# Altium schematic sheet FOC_Driver.SchDoc: 无刷电机控制器驱动电路
size A3; Engineer: LuHeQiu; Revision: v0.1; SheetNumber: 2; SheetTotal: 2; Website1: https://www.luheqiu.com; Website2: https://gitee.com/luheqiu; Contact: luheqiu@mail.luheqiu.com
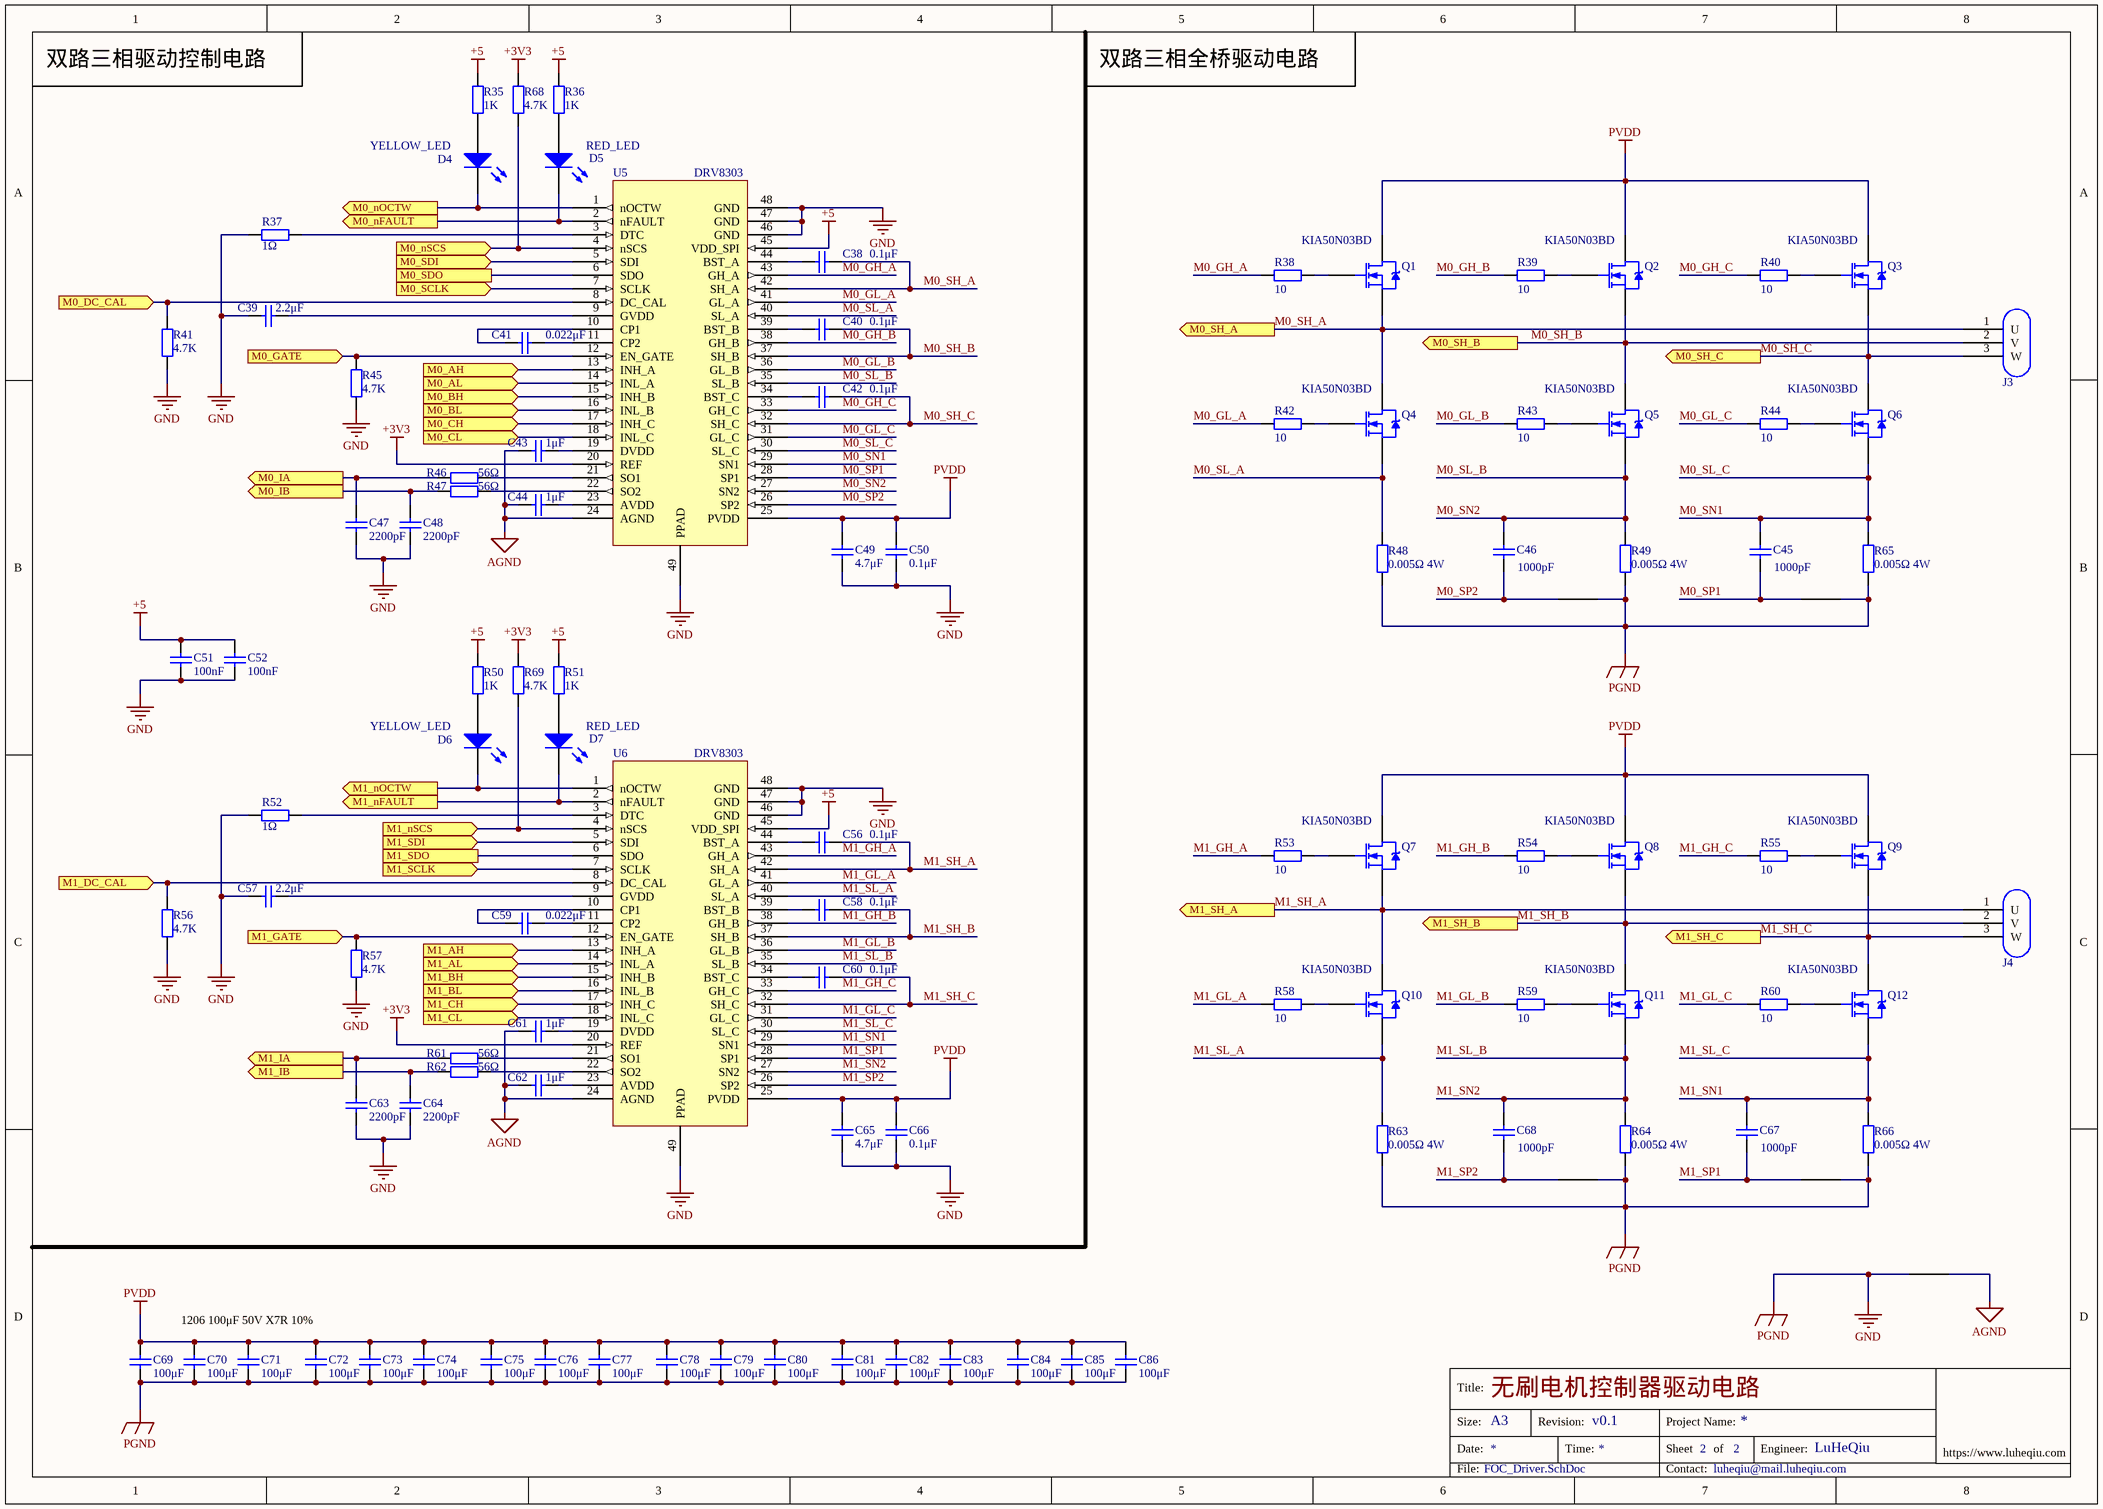
[diagram p0: FOC_Driver.SchDoc]

## Parts
C38  value 0.1μF  [C 0603_L]  (hidden comment: Cap)
C39  value 2.2μF  [C 0603_L]  (hidden comment: Cap)
C40  value 0.1μF  [C 0603_L]  (hidden comment: Cap)
C41  value 0.022μF  [C 0603_L]  (hidden comment: Cap)
C42  value 0.1μF  [C 0603_L]  (hidden comment: Cap)
C43  value 1μF  [C 0603_L]  (hidden comment: Cap)
C44  value 1μF  [C 0603_L]  (hidden comment: Cap)
C45  value 1000pF  [C 0603_L]  (hidden comment: Cap)
C46  value 1000pF  [C 0603_L]  (hidden comment: Cap)
C47  value 2200pF  [C 0603_L]  (hidden comment: Cap)
C48  value 2200pF  [C 0603_L]  (hidden comment: Cap)
C49  value 4.7μF  [C 0603_L]  (hidden comment: Cap)
C50  value 0.1μF  [C 0603_L]  (hidden comment: Cap)
C51  value 100nF  [C 0603_L]  (hidden comment: Cap)
C52  value 100nF  [C 0603_L]  (hidden comment: Cap)
C56  value 0.1μF  [C 0603_L]  (hidden comment: Cap)
C57  value 2.2μF  [C 0603_L]  (hidden comment: Cap)
C58  value 0.1μF  [C 0603_L]  (hidden comment: Cap)
C59  value 0.022μF  [C 0603_L]  (hidden comment: Cap)
C60  value 0.1μF  [C 0603_L]  (hidden comment: Cap)
C61  value 1μF  [C 0603_L]  (hidden comment: Cap)
C62  value 1μF  [C 0603_L]  (hidden comment: Cap)
C63  value 2200pF  [C 0603_L]  (hidden comment: Cap)
C64  value 2200pF  [C 0603_L]  (hidden comment: Cap)
C65  value 4.7μF  [C 0603_L]  (hidden comment: Cap)
C66  value 0.1μF  [C 0603_L]  (hidden comment: Cap)
C67  value 1000pF  [C 0603_L]  (hidden comment: Cap)
C68  value 1000pF  [C 0603_L]  (hidden comment: Cap)
C69  value 100μF  [C 1206_M]  (hidden comment: Cap)
C70  value 100μF  [C 1206_M]  (hidden comment: Cap)
C71  value 100μF  [C 1206_M]  (hidden comment: Cap)
C72  value 100μF  [C 1206_M]  (hidden comment: Cap)
C73  value 100μF  [C 1206_M]  (hidden comment: Cap)
C74  value 100μF  [C 1206_M]  (hidden comment: Cap)
C75  value 100μF  [C 1206_M]  (hidden comment: Cap)
C76  value 100μF  [C 1206_M]  (hidden comment: Cap)
C77  value 100μF  [C 1206_M]  (hidden comment: Cap)
C78  value 100μF  [C 1206_M]  (hidden comment: Cap)
C79  value 100μF  [C 1206_M]  (hidden comment: Cap)
C80  value 100μF  [C 1206_M]  (hidden comment: Cap)
C81  value 100μF  [C 1206_M]  (hidden comment: Cap)
C82  value 100μF  [C 1206_M]  (hidden comment: Cap)
C83  value 100μF  [C 1206_M]  (hidden comment: Cap)
C84  value 100μF  [C 1206_M]  (hidden comment: Cap)
C85  value 100μF  [C 1206_M]  (hidden comment: Cap)
C86  value 100μF  [C 1206_M]  (hidden comment: Cap)
D4  YELLOW_LED  [LED 0603Y]
D5  RED_LED  [LED 0603R]
D6  YELLOW_LED  [LED 0603Y]
D7  RED_LED  [LED 0603R]
J3  三相连接器-插座  [MR30PW-M]  (value not drawn)
J4  三相连接器-插座  [MR30PW-M]  (value not drawn)
NT1  Net Tie  [Net Tie]  (value not drawn)  (net tie, no BOM)
NT2  Net Tie  [Net Tie]  (value not drawn)  (net tie, no BOM)
NT3  Net Tie  [Net Tie]  (value not drawn)  (net tie, no BOM)
NT4  Net Tie  [Net Tie]  (value not drawn)  (net tie, no BOM)
NT5  Net Tie  [Net Tie 40mil]  (value not drawn)  (net tie, no BOM)
Q1  KIA50N03BD  [TO252 - 3]
Q2  KIA50N03BD  [TO252 - 3]
Q3  KIA50N03BD  [TO252 - 3]
Q4  KIA50N03BD  [TO252 - 3]
Q5  KIA50N03BD  [TO252 - 3]
Q6  KIA50N03BD  [TO252 - 3]
Q7  KIA50N03BD  [TO252 - 3]
Q8  KIA50N03BD  [TO252 - 3]
Q9  KIA50N03BD  [TO252 - 3]
Q10  KIA50N03BD  [TO252 - 3]
Q11  KIA50N03BD  [TO252 - 3]
Q12  KIA50N03BD  [TO252 - 3]
R35  value 1K  [R 0603_L]  (hidden comment: Res2)
R36  value 1K  [R 0603_L]  (hidden comment: Res2)
R37  value 1Ω  [R 0603_L]  (hidden comment: Res2)
R38  value 10  [R 0603_L]  (hidden comment: Res2)
R39  value 10  [R 0603_L]  (hidden comment: Res2)
R40  value 10  [R 0603_L]  (hidden comment: Res2)
R41  value 4.7K  [R 0603_L]  (hidden comment: Res2)
R42  value 10  [R 0603_L]  (hidden comment: Res2)
R43  value 10  [R 0603_L]  (hidden comment: Res2)
R44  value 10  [R 0603_L]  (hidden comment: Res2)
R45  value 4.7K  [R 0603_L]  (hidden comment: Res2)
R46  value 56Ω  [R 0603_L]  (hidden comment: Res2)
R47  value 56Ω  [R 0603_L]  (hidden comment: Res2)
R48  value 0.005Ω 4W  [R 2512_M]  (hidden comment: Res2)
R49  value 0.005Ω 4W  [R 2512_M]  (hidden comment: Res2)
R50  value 1K  [R 0603_L]  (hidden comment: Res2)
R51  value 1K  [R 0603_L]  (hidden comment: Res2)
R52  value 1Ω  [R 0603_L]  (hidden comment: Res2)
R53  value 10  [R 0603_L]  (hidden comment: Res2)
R54  value 10  [R 0603_L]  (hidden comment: Res2)
R55  value 10  [R 0603_L]  (hidden comment: Res2)
R56  value 4.7K  [R 0603_L]  (hidden comment: Res2)
R57  value 4.7K  [R 0603_L]  (hidden comment: Res2)
R58  value 10  [R 0603_L]  (hidden comment: Res2)
R59  value 10  [R 0603_L]  (hidden comment: Res2)
R60  value 10  [R 0603_L]  (hidden comment: Res2)
R61  value 56Ω  [R 0603_L]  (hidden comment: Res2)
R62  value 56Ω  [R 0603_L]  (hidden comment: Res2)
R63  value 0.005Ω 4W  [R 2512_M]  (hidden comment: Res2)
R64  value 0.005Ω 4W  [R 2512_M]  (hidden comment: Res2)
R65  value 0.005Ω 4W  [R 2512_M]  (hidden comment: Res2)
R66  value 0.005Ω 4W  [R 2512_M]  (hidden comment: Res2)
R68  value 4.7K  [R 0603_L]  (hidden comment: Res2)
R69  value 4.7K  [R 0603_L]  (hidden comment: Res2)
U5  DRV8303  [DCA48_4P42X3P48]
U6  DRV8303  [DCA48_4P42X3P48]

## Ports
M0_AH (in), M0_AL (in), M0_BH (in), M0_BL (in), M0_CH (in), M0_CL (in), M0_DC_CAL (in), M0_GATE (in), M0_IA (out), M0_IB (out), M0_nFAULT (out), M0_nOCTW (out), M0_nSCS (in), M0_SCLK (in), M0_SDI (in), M0_SDO, M0_SH_A (out), M0_SH_B (out), M0_SH_C (out), M1_AH (in), M1_AL (in), M1_BH (in), M1_BL (in), M1_CH (in), M1_CL (in), M1_DC_CAL (in), M1_GATE (in), M1_IA (out), M1_IB (out), M1_nFAULT (out), M1_nOCTW (out), M1_nSCS (in), M1_SCLK (in), M1_SDI (in), M1_SDO, M1_SH_A (out), M1_SH_B (out), M1_SH_C (out)

## Nets
+3V3: R68.2 R69.2 U5.20(REF) U6.20(REF)
+5: C51.1 C52.1 R35.2 R36.2 R50.2 R51.2 U5.45(VDD_SPI) U6.45(VDD_SPI)
AGND: C43.1 C44.1 C61.1 C62.1 NT5.2 U5.24(AGND) U6.24(AGND)
GND: C39.1 C47.1 C48.1 C49.2 C50.2 C51.2 C52.2 C57.1 C63.1 C64.1 C65.2 C66.2 C69.2 C70.2 C71.2 C72.2 C73.2 C74.2 C75.2 C76.2 C77.2 C78.2 C79.2 C80.2 C81.2 C82.2 C83.2 C84.2 C85.2 C86.2 NT1.2 NT2.2 NT3.2 NT4.2 NT5.1 R37.2 R41.1 R45.1 R48.1 R49.1 R52.2 R56.1 R57.1 R63.1 R64.1 R65.1 R66.1 U5.46(GND) U5.47(GND) U5.48(GND) U5.49(PPAD) U6.46(GND) U6.47(GND) U6.48(GND) U6.49(PPAD)  [also labelled PGND]
PVDD: C49.1 C50.1 C65.1 C66.1 C69.1 C70.1 C71.1 C72.1 C73.1 C74.1 C75.1 C76.1 C77.1 C78.1 C79.1 C80.1 C81.1 C82.1 C83.1 C84.1 C85.1 C86.1 Q1.2(D) Q2.2(D) Q3.2(D) Q7.2(D) Q8.2(D) Q9.2(D) U5.25(PVDD) U6.25(PVDD)
M0_AH: U5.13(INH_A) ; port M0_AH
M0_AL: U5.14(INL_A) ; port M0_AL
M0_BH: U5.15(INH_B) ; port M0_BH
M0_BL: U5.16(INL_B) ; port M0_BL
M0_CH: U5.17(INH_C) ; port M0_CH
M0_CL: U5.18(INL_C) ; port M0_CL
M0_DC_CAL: R41.2 U5.8(DC_CAL) ; port M0_DC_CAL
M0_GATE: R45.2 U5.12(EN_GATE) ; port M0_GATE
M0_GH_A: R38.1 U5.43(GH_A)
M0_GH_B: R39.1 U5.38(GH_B)
M0_GH_C: R40.1 U5.33(GH_C)
M0_GL_A: R42.1 U5.41(GL_A)
M0_GL_B: R43.1 U5.36(GL_B)
M0_GL_C: R44.1 U5.31(GL_C)
M0_IA: C47.2 R46.2 ; port M0_IA
M0_IB: C48.2 R47.2 ; port M0_IB
M0_nFAULT: D5.2(K) U5.2(nFAULT) ; port M0_nFAULT
M0_nOCTW: D4.2(K) U5.1(nOCTW) ; port M0_nOCTW
M0_nSCS: R68.1 U5.4(nSCS) ; port M0_nSCS
M0_SCLK: U5.7(SCLK) ; port M0_SCLK
M0_SDI: U5.5(SDI) ; port M0_SDI
M0_SDO: U5.6(SDO) ; port M0_SDO
M0_SH_A: C38.1 J3.1(U) Q1.3(S) Q4.2(D) U5.42(SH_A) ; port M0_SH_A
M0_SH_B: C40.1 J3.2(V) Q2.3(S) Q5.2(D) U5.37(SH_B) ; port M0_SH_B
M0_SH_C: C42.1 J3.3(W) Q3.3(S) Q6.2(D) U5.32(SH_C) ; port M0_SH_C
M0_SL_A: Q4.3(S) R48.2 U5.40(SL_A)
M0_SL_B: C46.2 Q5.3(S) R49.2 U5.27(SN2) U5.35(SL_B)  [also labelled M0_SN2]
M0_SL_C: C45.2 Q6.3(S) R65.2 U5.29(SN1) U5.30(SL_C)  [also labelled M0_SN1]
M0_SP1: C45.1 NT2.1 U5.28(SP1)
M0_SP2: C46.1 NT1.1 U5.26(SP2)
M1_AH: U6.13(INH_A) ; port M1_AH
M1_AL: U6.14(INL_A) ; port M1_AL
M1_BH: U6.15(INH_B) ; port M1_BH
M1_BL: U6.16(INL_B) ; port M1_BL
M1_CH: U6.17(INH_C) ; port M1_CH
M1_CL: U6.18(INL_C) ; port M1_CL
M1_DC_CAL: R56.2 U6.8(DC_CAL) ; port M1_DC_CAL
M1_GATE: R57.2 U6.12(EN_GATE) ; port M1_GATE
M1_GH_A: R53.1 U6.43(GH_A)
M1_GH_B: R54.1 U6.38(GH_B)
M1_GH_C: R55.1 U6.33(GH_C)
M1_GL_A: R58.1 U6.41(GL_A)
M1_GL_B: R59.1 U6.36(GL_B)
M1_GL_C: R60.1 U6.31(GL_C)
M1_IA: C63.2 R61.2 ; port M1_IA
M1_IB: C64.2 R62.2 ; port M1_IB
M1_nFAULT: D7.2(K) U6.2(nFAULT) ; port M1_nFAULT
M1_nOCTW: D6.2(K) U6.1(nOCTW) ; port M1_nOCTW
M1_nSCS: R69.1 U6.4(nSCS) ; port M1_nSCS
M1_SCLK: U6.7(SCLK) ; port M1_SCLK
M1_SDI: U6.5(SDI) ; port M1_SDI
M1_SDO: U6.6(SDO) ; port M1_SDO
M1_SH_A: C56.1 J4.1(U) Q7.3(S) Q10.2(D) U6.42(SH_A) ; port M1_SH_A
M1_SH_B: C58.1 J4.2(V) Q8.3(S) Q11.2(D) U6.37(SH_B) ; port M1_SH_B
M1_SH_C: C60.1 J4.3(W) Q9.3(S) Q12.2(D) U6.32(SH_C) ; port M1_SH_C
M1_SL_A: Q10.3(S) R63.2 U6.40(SL_A)
M1_SL_B: C68.2 Q11.3(S) R64.2 U6.27(SN2) U6.35(SL_B)  [also labelled M1_SN2]
M1_SL_C: C67.2 Q12.3(S) R66.2 U6.29(SN1) U6.30(SL_C)  [also labelled M1_SN1]
M1_SP1: C67.1 NT4.1 U6.28(SP1)
M1_SP2: C68.1 NT3.1 U6.26(SP2)
NetC38_2: C38.2 U5.44(BST_A)
NetC39_2: C39.2 U5.9(GVDD)
NetC40_2: C40.2 U5.39(BST_B)
NetC41_1: C41.1 U5.11(CP2)
NetC41_2: C41.2 U5.10(CP1)
NetC42_2: C42.2 U5.34(BST_C)
NetC43_2: C43.2 U5.19(DVDD)
NetC44_2: C44.2 U5.23(AVDD)
NetC56_2: C56.2 U6.44(BST_A)
NetC57_2: C57.2 U6.9(GVDD)
NetC58_2: C58.2 U6.39(BST_B)
NetC59_1: C59.1 U6.11(CP2)
NetC59_2: C59.2 U6.10(CP1)
NetC60_2: C60.2 U6.34(BST_C)
NetC61_2: C61.2 U6.19(DVDD)
NetC62_2: C62.2 U6.23(AVDD)
NetD4_1: D4.1(A) R35.1
NetD5_1: D5.1(A) R36.1
NetD6_1: D6.1(A) R50.1
NetD7_1: D7.1(A) R51.1
NetQ1_1: Q1.1(G) R38.2
NetQ2_1: Q2.1(G) R39.2
NetQ3_1: Q3.1(G) R40.2
NetQ4_1: Q4.1(G) R42.2
NetQ5_1: Q5.1(G) R43.2
NetQ6_1: Q6.1(G) R44.2
NetQ7_1: Q7.1(G) R53.2
NetQ8_1: Q8.1(G) R54.2
NetQ9_1: Q9.1(G) R55.2
NetQ10_1: Q10.1(G) R58.2
NetQ11_1: Q11.1(G) R59.2
NetQ12_1: Q12.1(G) R60.2
NetR37_1: R37.1 U5.3(DTC)
NetR46_1: R46.1 U5.21(SO1)
NetR47_1: R47.1 U5.22(SO2)
NetR52_1: R52.1 U6.3(DTC)
NetR61_1: R61.1 U6.21(SO1)
NetR62_1: R62.1 U6.22(SO2)

## Notes on the sheet
- 双路三相驱动控制电路
- 双路三相全桥驱动电路
- 1206 100μF 50V X7R 10%
- Title:
- Size:
- Date:
- A3
- Revision:
- Time:
- Project Name:
- Sheet
- of
- Engineer:
- File:
- Contact:

## Library data of the parts
C38-C52 C56-C86 = Cap: Capacitor; Published: 8-Jun-2000; LatestRevisionDate: 17-Jul-2002; LatestRevisionNote: Re-released for DXP Platform.; PackageReference: RAD-0.3; Publisher: Altium Limited; PackageDescription: Radial Cap, Thru-Hole; 2 Leads; 0.3 in Pin Spacing
D4-D7 = LED2: Typical RED, GREEN, YELLOW, AMBER GaAs LED; Published: 8-Jun-2000; LatestRevisionDate: 17-Jul-2002; LatestRevisionNote: Re-released for DXP Platform.; PackageVersion: Feb-2002; PackageReference: 3.2X1.6X1.1; Publisher: Altium Limited; PackageDescription: SM LED; 2 Flat Leads
Q1-Q12 = N-MOSFET
R35-R66 R68 R69 = Res2: Resistor; Published: 8-Jun-2000; LatestRevisionDate: 17-Jul-2002; LatestRevisionNote: Re-released for DXP Platform.; PackageReference: AXIAL-0.4; Publisher: Altium Limited; PackageDescription: Axial Device, Thru-Hole; 2 Leads; 0.4 in Pin Spacing
U5 U6 = DRV8303: THREE PHASE PRE-DRIVER WITH DUAL CURRENT SHUNT AMPLIFIERS, DCA0048A